# EAGLE design rgb_strip_x5 (EAGLE 6.6.0)
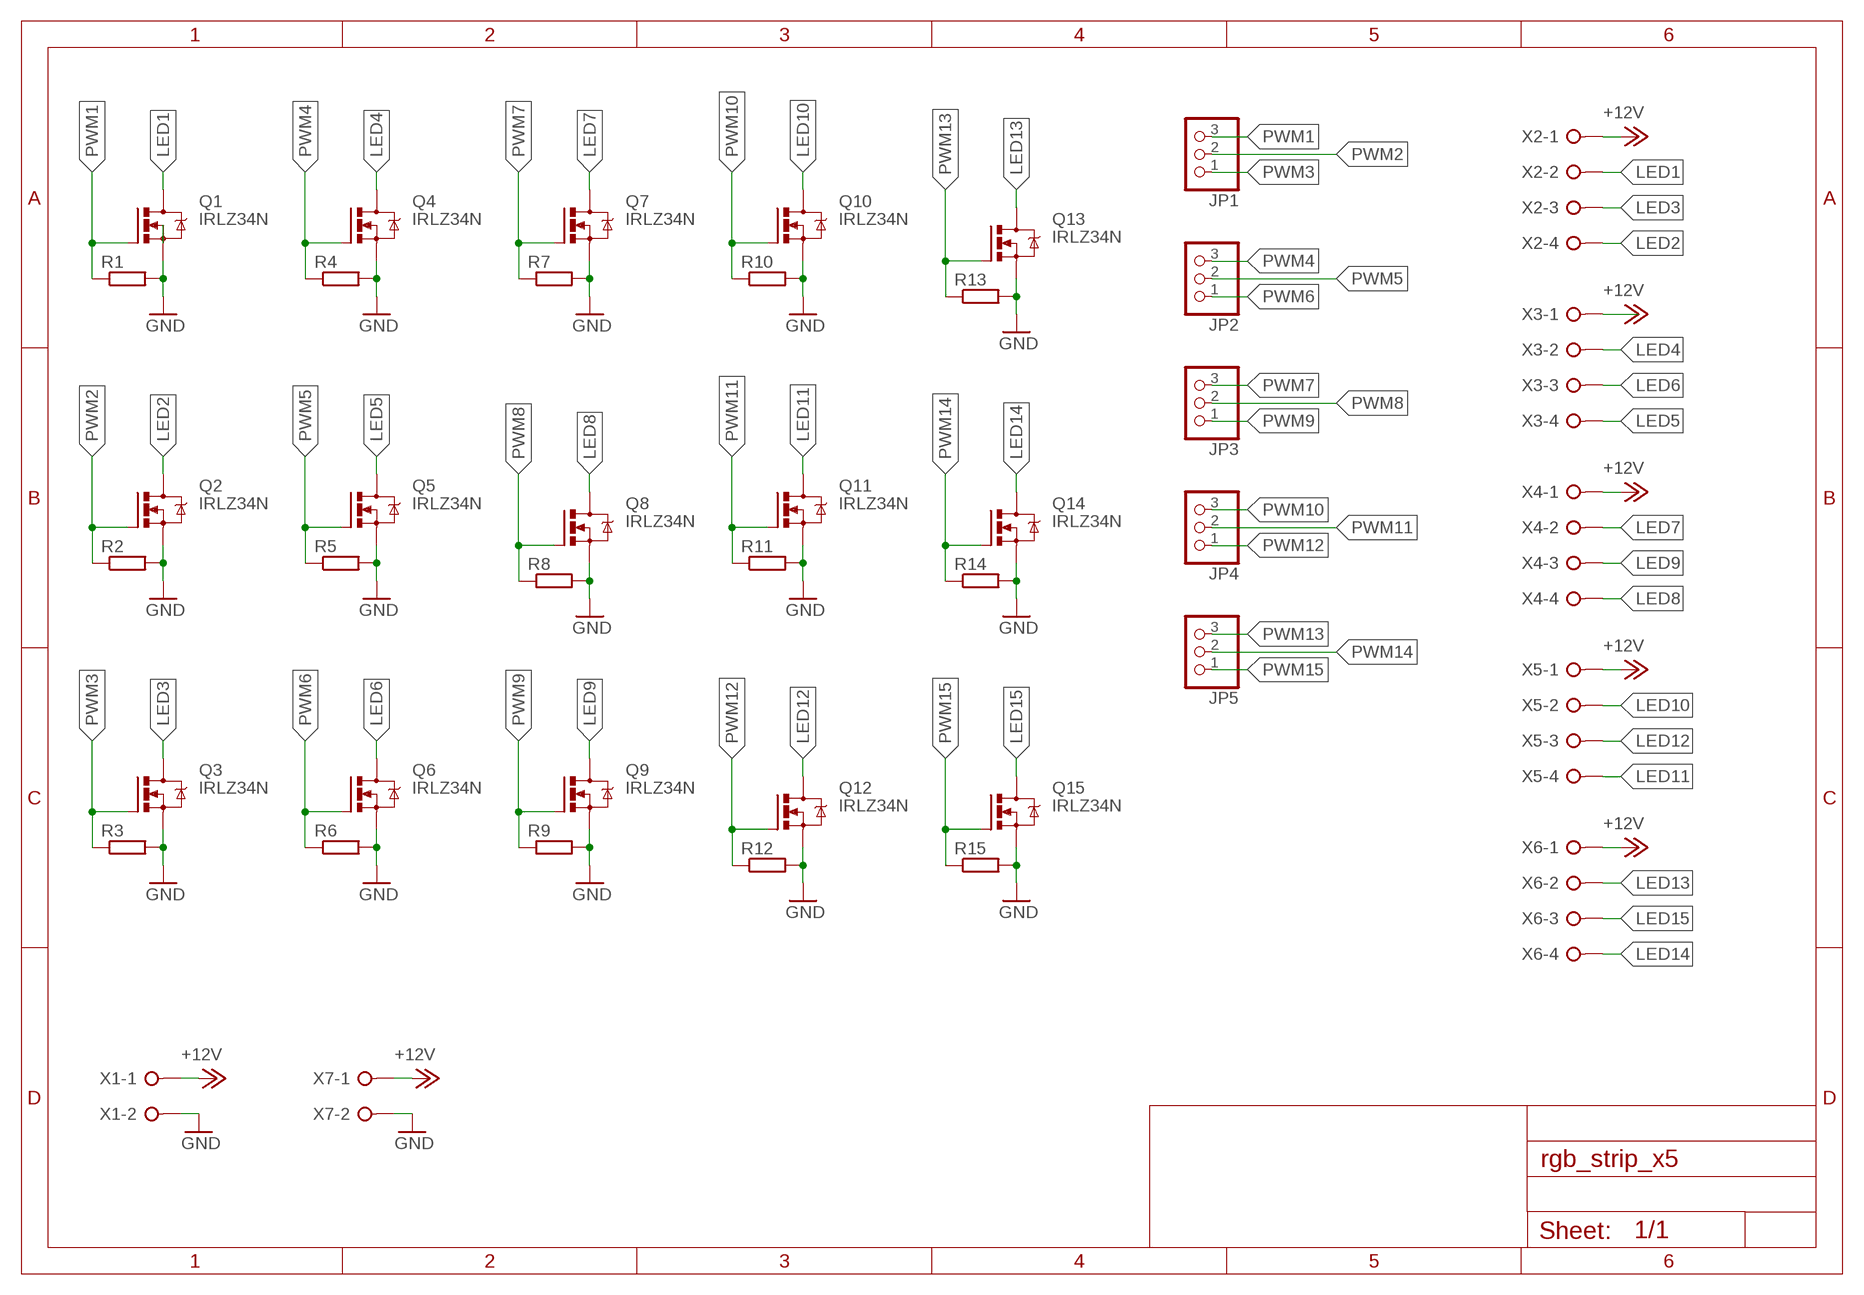
[diagram p0: schematic, sheet 1]

## Parts
JP1  PINHD-1X3  [1X03]
JP2  PINHD-1X3  [1X03]
JP3  PINHD-1X3  [1X03]
JP4  PINHD-1X3  [1X03]
JP5  PINHD-1X3  [1X03]
Q1  IRLZ34N  IRLZ44ZTO220BV  [TO220BV]
Q2  IRLZ34N  IRLZ44ZTO220BV  [TO220BV]
Q3  IRLZ34N  IRLZ44ZTO220BV  [TO220BV]
Q4  IRLZ34N  IRLZ44ZTO220BV  [TO220BV]
Q5  IRLZ34N  IRLZ44ZTO220BV  [TO220BV]
Q6  IRLZ34N  IRLZ44ZTO220BV  [TO220BV]
Q7  IRLZ34N  IRLZ44ZTO220BV  [TO220BV]
Q8  IRLZ34N  IRLZ44ZTO220BV  [TO220BV]
Q9  IRLZ34N  IRLZ44ZTO220BV  [TO220BV]
Q10  IRLZ34N  IRLZ44ZTO220BV  [TO220BV]
Q11  IRLZ34N  IRLZ44ZTO220BV  [TO220BV]
Q12  IRLZ34N  IRLZ44ZTO220BV  [TO220BV]
Q13  IRLZ34N  IRLZ44ZTO220BV  [TO220BV]
Q14  IRLZ34N  IRLZ44ZTO220BV  [TO220BV]
Q15  IRLZ34N  IRLZ44ZTO220BV  [TO220BV]
R1  R-EU_0207/10  [0207/10]
R2  R-EU_0207/10  [0207/10]
R3  R-EU_0207/10  [0207/10]
R4  R-EU_0207/10  [0207/10]
R5  R-EU_0207/10  [0207/10]
R6  R-EU_0207/10  [0207/10]
R7  R-EU_0207/10  [0207/10]
R8  R-EU_0207/10  [0207/10]
R9  R-EU_0207/10  [0207/10]
R10  R-EU_0207/10  [0207/10]
R11  R-EU_0207/10  [0207/10]
R12  R-EU_0207/10  [0207/10]
R13  R-EU_0207/10  [0207/10]
R14  R-EU_0207/10  [0207/10]
R15  R-EU_0207/10  [0207/10]
X1  W237-02P  [W237-132]
X2  W237-04P  [W237-4P]
X3  W237-04P  [W237-4P]
X4  W237-04P  [W237-4P]
X5  W237-04P  [W237-4P]
X6  W237-04P  [W237-4P]
X7  W237-02P  [W237-132]

## Nets
+12V: X1.1 X2.1 X3.1 X4.1 X5.1 X6.1 X7.1
GND: Q1.S Q2.S Q3.S Q4.S Q5.S Q6.S Q7.S Q8.S Q9.S Q10.S Q11.S Q12.S Q13.S Q14.S Q15.S R1.2 R2.2 R3.2 R4.2 R5.2 R6.2 R7.2 R8.2 R9.2 R10.2 R11.2 R12.2 R13.2 R14.2 R15.2 X1.2 X7.2
LED1: Q1.D X2.2
LED2: Q2.D X2.4
LED3: Q3.D X2.3
LED4: Q4.D X3.2
LED5: Q5.D X3.4
LED6: Q6.D X3.3
LED7: Q7.D X4.2
LED8: Q8.D X4.4
LED9: Q9.D X4.3
LED10: Q10.D X5.2
LED11: Q11.D X5.4
LED12: Q12.D X5.3
LED13: Q13.D X6.2
LED14: Q14.D X6.4
LED15: Q15.D X6.3
PWM1: JP1.3 Q1.G R1.1
PWM2: JP1.2 Q2.G R2.1
PWM3: JP1.1 Q3.G R3.1
PWM4: JP2.3 Q4.G R4.1
PWM5: JP2.2 Q5.G R5.1
PWM6: JP2.1 Q6.G R6.1
PWM7: JP3.3 Q7.G R7.1
PWM8: JP3.2 Q8.G R8.1
PWM9: JP3.1 Q9.G R9.1
PWM10: JP4.3 Q10.G R10.1
PWM11: JP4.2 Q11.G R11.1
PWM12: JP4.1 Q12.G R12.1
PWM13: JP5.3 Q13.G R13.1
PWM14: JP5.2 Q14.G R14.1
PWM15: JP5.1 Q15.G R15.1

## Library data of the parts
JP1-JP5 = pinhead:PINHD-1X3: PIN HEADER
Q1-Q15 = transistor-power:IRLZ44Z: N-Channel HEXFET® Power MOSFET Logic Level AUTOMOTIVE MOSFET Source: http://www.irf.com/product-info/datasheets/data/irlz44zpbf.pdf
R1-R15 = resistor:R-EU_: RESISTOR, European symbol
X1 X7 = con-wago-508:W237-02P: WAGO SREW CLAMP; OC_FARNELL: unknown; OC_NEWARK: unknown
X2-X6 = con-wago-508:W237-04P: WAGO SREW CLAMP; OC_FARNELL: unknown; OC_NEWARK: unknown

## Board
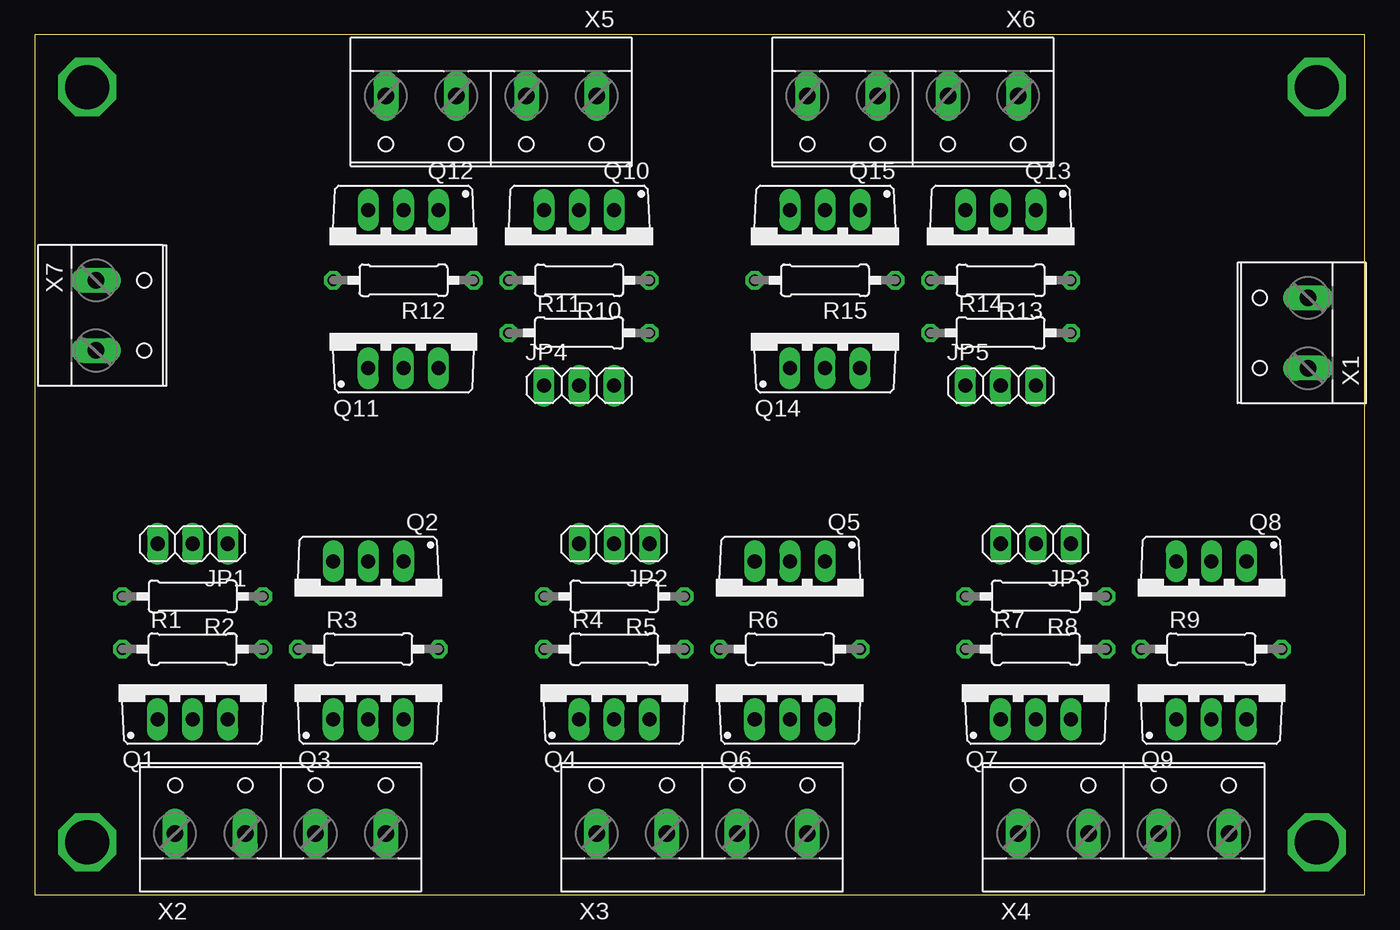
[diagram p1: board, top side]
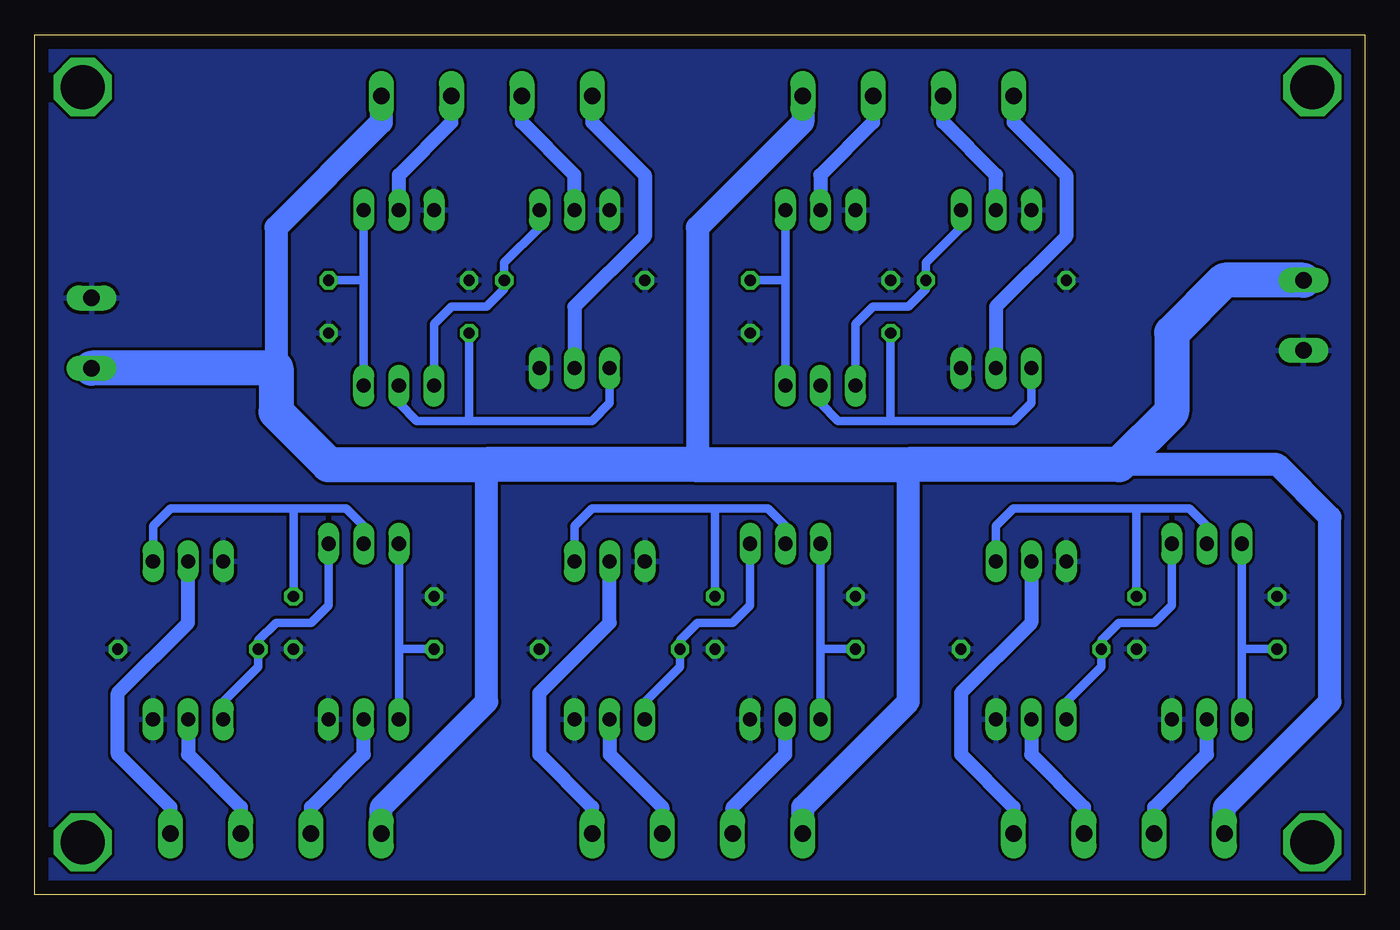
[diagram p2: board, bottom side, seen from below]

Size 96.19 x 62.22 mm. Coordinates in mm from the lower left corner, seen from the top.
Outline: 0,0 96.19,0 96.19,62.22 0,62.22 0,0
Copper layers (1*16): Top 0.035mm / dielectric 1.5mm / Bottom 0.035mm
Design rules "default": minimum track width 10mil, minimum drill 24mil, track to track 8mil, track to pad 8mil, pad to pad 8mil, via to via 8mil, smd to smd 8mil, copper to edge 40mil, drill to drill 8mil, minimum pad ring 10mil, minimum via ring 8mil, stop-mask expansion 4mil, vias tented up to drill 0mil, thermal gap 10mil

### Footprints (pad centres in the part's own frame; a part is rotated, then mirrored left to right if it is on the bottom)
1X03 = drill 1.016 long: 1 -2.54,0; 2 0,0; 3 2.54,0
TO220BV = drill 1.016 long: D 0,-2.54; G -2.54,-2.54; S 2.54,-2.54
0207/10 = drill 0.813 octagon: 1 -5.08,0; 2 5.08,0
W237-132 = drill 1.194 long: 1 -2.54,-0.635; 2 2.54,-0.635
W237-4P = drill 1.194 long: 1 -7.62,-0.635; 2 -2.54,-0.635; 3 2.54,-0.635; 4 7.62,-0.635

### Placement (x,y rotation side)
JP1  11.43,25.4 180 top
JP2  41.91,25.4 180 top
JP3  72.39,25.4 180 top
JP4  39.37,36.83 0 top
JP5  69.85,36.83 0 top
Q1  11.43,15.24 0 top
Q2  24.13,21.59 180 top
Q3  24.13,15.24 0 top
Q4  41.91,15.24 0 top
Q5  54.61,21.59 180 top
Q6  54.61,15.24 0 top
Q7  72.39,15.24 0 top
Q8  85.09,21.59 180 top
Q9  85.09,15.24 0 top
Q10  39.37,46.99 180 top
Q11  26.67,40.64 0 top
Q12  26.67,46.99 180 top
Q13  69.85,46.99 180 top
Q14  57.15,40.64 0 top
Q15  57.15,46.99 180 top
R1  11.43,17.78 0 top
R2  11.43,21.59 180 top
R3  24.13,17.78 0 top
R4  41.91,17.78 0 top
R5  41.91,21.59 180 top
R6  54.61,17.78 0 top
R7  72.39,17.78 0 top
R8  72.39,21.59 180 top
R9  85.09,17.78 0 top
R10  39.37,44.45 180 top
R11  39.37,40.64 0 top
R12  26.67,44.45 180 top
R13  69.85,44.45 180 top
R14  69.85,40.64 0 top
R15  57.15,44.45 180 top
X1  91.44,40.64 90 top
X2  17.78,5.08 0 top
X3  48.26,5.08 0 top
X4  78.74,5.08 0 top
X5  33.02,57.15 180 top
X6  63.5,57.15 180 top
X7  5.08,41.91 270 top

### Tracks (layer width: path | path; a pad name or v marks a point on that pad's centre or on a via)
+12V
  Bottom 1.676: X2.1 10.16,6.35 2.54,13.97 2.54,27.3 6.35,31.11 17.78,31.11 | X3.1 40.64,6.35 33.02,13.97 33.02,31.11 | X4.1 71.12,6.35 63.5,13.97 63.5,31.11 | X5.1 40.64,55.88 48.26,48.26 48.26,31.11 | X6.1 71.12,55.88 78.74,48.26 78.74,38.1
  Bottom 2.54: X1.1 78.74,38.1 78.74,34.92 74.93,31.11 63.5,31.11 48.26,31.11 33.02,31.11 17.78,31.11 13.97,34.92 13.97,40.64 10.16,44.45 X7.1
GND
  pour Bottom: 0,62.23 0,0 96.52,0 96.52,62.23
LED1
  Bottom 1.016: X2.2 15.24,6.35 11.43,10.16 Q1.D
LED2
  Bottom 1.016: Q2.D 24.13,19.68 29.21,14.61 29.21,10.16 25.4,6.35 X2.4
LED3
  Bottom 1.016: Q3.D 24.13,10.16 20.32,6.35 X2.3
LED4
  Bottom 1.016: X3.2 45.72,6.35 41.91,10.16 Q4.D
LED5
  Bottom 1.016: X3.4 55.88,6.35 59.69,10.16 59.69,14.61 54.61,19.68 Q5.D
LED6
  Bottom 1.016: Q6.D 54.61,10.16 50.8,6.35 X3.3
LED7
  Bottom 1.016: X4.2 76.2,6.35 72.39,10.16 Q7.D
LED8
  Bottom 1.016: X4.4 86.36,6.35 90.17,10.16 90.17,14.61 85.09,19.68 Q8.D
LED9
  Bottom 1.016: Q9.D 85.09,10.16 81.28,6.35 X4.3
LED10
  Bottom 1.016: X5.2 35.56,55.88 39.37,52.07 Q10.D
LED11
  Bottom 1.016: X5.4 25.4,55.88 21.59,52.07 21.59,47.62 26.67,42.55 Q11.D
LED12
  Bottom 1.016: Q12.D 26.67,52.07 30.48,55.88 X5.3
LED13
  Bottom 1.016: Q13.D 69.85,52.07 66.04,55.88 X6.2
LED14
  Bottom 1.016: X6.4 55.88,55.88 52.07,52.07 52.07,47.62 57.15,42.55 Q14.D
LED15
  Bottom 1.016: Q15.D 57.15,52.07 60.96,55.88 X6.3
N$1  (via drill 3.2)
  other vias: 92.71,58.42
N$2  (via drill 3.2)
  other vias: 92.71,3.81
N$3  (via drill 3.2)
  other vias: 3.81,3.81
N$4  (via drill 3.2)
  other vias: 3.81,58.42
PWM1
  Bottom 0.61: JP1.3 8.89,17.78 | 8.89,17.78 Q1.G | R1.1 8.89,17.78
PWM2
  Bottom 0.61: Q2.G 26.67,26.67 25.4,27.94 16.51,27.94 | 16.51,27.94 12.7,27.94 11.43,26.67 JP1.2 | R2.1 16.51,27.94
PWM3
  Bottom 0.61: Q3.G 21.59,13.97 19.05,16.51 R3.1 19.05,18.41 17.78,19.68 15.24,19.68 13.97,20.95 JP1.1
PWM4
  Bottom 0.61: Q4.G 39.37,17.78 | 39.37,17.78 JP2.3 | R4.1 39.37,17.78
PWM5
  Bottom 0.61: JP2.2 41.91,26.67 43.18,27.94 46.99,27.94 | 46.99,27.94 55.88,27.94 57.15,26.67 Q5.G | R5.1 46.99,27.94
PWM6
  Bottom 0.61: JP2.1 44.45,20.95 45.72,19.68 48.26,19.68 49.53,18.41 R6.1 49.53,16.51 52.07,13.97 Q6.G
PWM7
  Bottom 0.61: Q7.G 69.85,17.78 | 69.85,17.78 JP3.3 | R7.1 69.85,17.78
PWM8
  Bottom 0.61: Q8.G 87.63,26.67 86.36,27.94 77.47,27.94 | 77.47,27.94 73.66,27.94 72.39,26.67 JP3.2 | R8.1 77.47,27.94
PWM9
  Bottom 0.61: JP3.1 74.93,20.95 76.2,19.68 78.74,19.68 80.01,18.41 R9.1 80.01,16.51 82.55,13.97 Q9.G
PWM10
  Bottom 0.61: Q10.G 41.91,44.45 | 41.91,44.45 JP4.3 | R10.1 41.91,44.45
PWM11
  Bottom 0.61: JP4.2 39.37,35.56 38.1,34.29 34.29,34.29 | 34.29,34.29 25.4,34.29 24.13,35.56 Q11.G | R11.1 34.29,34.29
PWM12
  Bottom 0.61: JP4.1 36.83,41.27 35.56,42.55 33.02,42.55 31.75,43.81 R12.1 31.75,45.72 29.21,48.26 Q12.G
PWM13
  Bottom 0.61: Q13.G 72.39,44.45 | 72.39,44.45 JP5.3 | R13.1 72.39,44.45
PWM14
  Bottom 0.61: JP5.2 69.85,35.56 68.58,34.29 64.77,34.29 | 64.77,34.29 55.88,34.29 54.61,35.56 Q14.G | R14.1 64.77,34.29
PWM15
  Bottom 0.61: JP5.1 67.31,41.27 66.04,42.55 63.5,42.55 62.23,43.81 R15.1 62.23,45.72 59.69,48.26 Q15.G